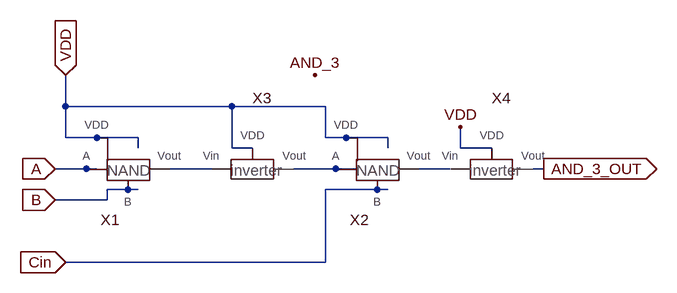
[diagram p0: schematic AND_3.asc]
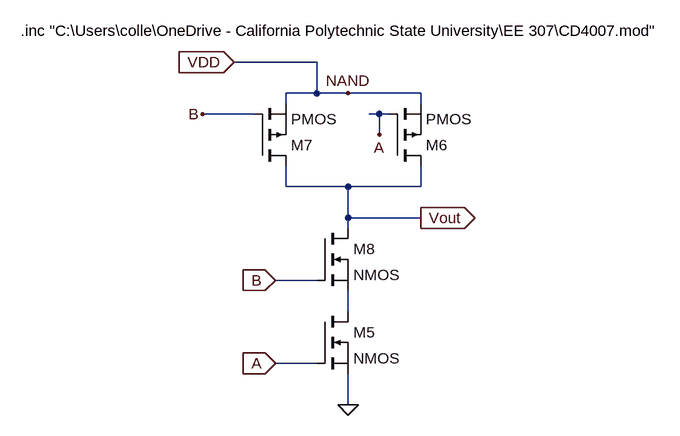
[diagram p1: sub-circuit nand_gate.asc]
AND_3.asc, the LTspice schematic file:
Version 4
SHEET 1 984 680
WIRE 48 64 48 16
WIRE 304 64 48 64
WIRE 448 64 304 64
WIRE 48 112 48 64
WIRE 160 112 48 112
WIRE 448 112 448 64
WIRE 544 112 448 112
WIRE 160 128 160 112
WIRE 304 128 304 64
WIRE 336 128 304 128
WIRE 544 128 544 112
WIRE 656 128 656 96
WIRE 704 128 656 128
WIRE 96 160 32 160
WIRE 224 160 208 160
WIRE 272 160 224 160
WIRE 480 160 400 160
WIRE 496 160 480 160
WIRE 608 160 592 160
WIRE 640 160 608 160
WIRE 784 160 768 160
WIRE 160 192 112 192
WIRE 544 192 448 192
WIRE 112 208 112 192
WIRE 112 208 32 208
WIRE 448 304 448 192
WIRE 448 304 48 304
FLAG 432 16 AND_3
FLAG 48 304 Cin
IOPIN 48 304 In
FLAG 32 160 A
IOPIN 32 160 In
FLAG 32 208 B
IOPIN 32 208 In
FLAG 48 16 VDD
IOPIN 48 16 In
FLAG 784 160 AND_3_OUT
IOPIN 784 160 Out
FLAG 656 96 VDD
SYMBOL Nand_gate 192 176 R0
SYMATTR InstName X1
SYMBOL Nand_gate 576 176 R0
SYMATTR InstName X2
SYMBOL Inverter 368 176 R0
SYMATTR InstName X3
SYMBOL Inverter 736 176 R0
SYMATTR InstName X4

nand_gate.asc, the sub-circuit schematic file:
Version 4
SHEET 1 880 680
WIRE -224 -192 -352 -192
WIRE -224 -144 -224 -192
WIRE -224 -144 -272 -144
WIRE -176 -144 -224 -144
WIRE -64 -144 -176 -144
WIRE -272 -128 -272 -144
WIRE -64 -128 -64 -144
WIRE -320 -112 -400 -112
WIRE -128 -112 -144 -112
WIRE -112 -112 -128 -112
WIRE -128 -80 -128 -112
WIRE -272 0 -272 -32
WIRE -176 0 -272 0
WIRE -64 0 -64 -32
WIRE -64 0 -176 0
WIRE -176 48 -176 0
WIRE -64 48 -176 48
WIRE -176 64 -176 48
WIRE -224 144 -288 144
WIRE -176 192 -176 160
WIRE -224 272 -288 272
WIRE -176 336 -176 288
FLAG -176 -144 NAND
FLAG -176 336 0
FLAG -288 272 A
IOPIN -288 272 In
FLAG -128 -80 A
FLAG -400 -112 B
FLAG -288 144 B
IOPIN -288 144 In
FLAG -64 48 Vout
IOPIN -64 48 Out
FLAG -352 -192 VDD
IOPIN -352 -192 In
SYMBOL nmos -224 192 R0
SYMATTR InstName M5
SYMBOL pmos -112 -32 M180
SYMATTR InstName M6
SYMBOL pmos -320 -32 M180
SYMATTR InstName M7
SYMBOL nmos -224 64 R0
SYMATTR InstName M8
TEXT -680 -240 Left 2 !.inc "C:\\Users\\colle\\OneDrive - California Polytechnic State University\\EE 307\\CD4007.mod"

The netlist it stands for:
* AND_3.asc
XX1 A B N001 VDD nand_gate
XX2 N002 Cin N003 VDD nand_gate
XX3 N001 VDD N002 Inverter  ; pins Vin VDD Vout
XX4 N003 VDD AND_3_OUT Inverter  ; pins Vin VDD Vout

* block symbol definitions
.subckt nand_gate A B Vout VDD
M5 N001 A 0 0 NMOS
M6 Vout A VDD VDD PMOS
M7 Vout B VDD VDD PMOS
M8 Vout B N001 N001 NMOS
.inc "C:\Users\colle\OneDrive - California Polytechnic State University\EE 307\CD4007.mod"
.ends nand_gate

.model NMOS NMOS
.model PMOS PMOS
.lib standard.mos
.backanno
.end